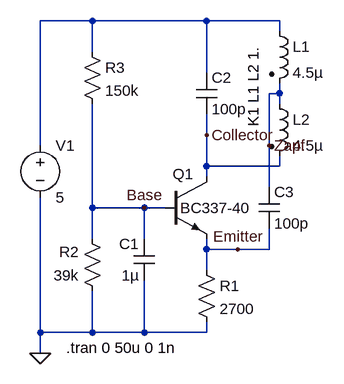
[diagram p0: schematic Draft6.asc]
Draft6.asc, the LTspice schematic file:
Version 4
SHEET 1 880 680
WIRE -752 -512 -832 -512
WIRE -576 -512 -752 -512
WIRE -464 -512 -576 -512
WIRE -464 -496 -464 -512
WIRE -752 -464 -752 -512
WIRE -576 -432 -576 -512
WIRE -464 -400 -464 -416
WIRE -464 -400 -480 -400
WIRE -464 -384 -464 -400
WIRE -576 -336 -576 -368
WIRE -832 -320 -832 -512
WIRE -480 -320 -480 -400
WIRE -576 -288 -576 -336
WIRE -464 -288 -464 -304
WIRE -464 -288 -576 -288
WIRE -576 -272 -576 -288
WIRE -480 -256 -480 -320
WIRE -752 -224 -752 -384
WIRE -672 -224 -752 -224
WIRE -640 -224 -672 -224
WIRE -752 -176 -752 -224
WIRE -672 -176 -672 -224
WIRE -576 -160 -576 -176
WIRE -528 -160 -576 -160
WIRE -480 -160 -480 -192
WIRE -480 -160 -528 -160
WIRE -576 -128 -576 -160
WIRE -832 -32 -832 -240
WIRE -752 -32 -752 -96
WIRE -752 -32 -832 -32
WIRE -672 -32 -672 -112
WIRE -672 -32 -752 -32
WIRE -576 -32 -576 -48
WIRE -576 -32 -672 -32
WIRE -832 0 -832 -32
FLAG -832 0 0
FLAG -672 -224 Base
FLAG -576 -336 Collector
FLAG -528 -160 Emitter
FLAG -480 -320 Zapf
SYMBOL ind2 -480 -512 R0
SYMATTR InstName L1
SYMATTR Value 4.5µ
SYMATTR Type ind
SYMBOL cap -656 -112 R180
WINDOW 0 24 56 Left 2
WINDOW 3 24 8 Left 2
SYMATTR InstName C1
SYMATTR Value 1µ
SYMBOL cap -592 -432 R0
SYMATTR InstName C2
SYMATTR Value 100p
SYMBOL cap -496 -256 R0
SYMATTR InstName C3
SYMATTR Value 100p
SYMBOL res -592 -144 R0
SYMATTR InstName R1
SYMATTR Value 2700
SYMBOL res -736 -80 R180
WINDOW 0 36 76 Left 2
WINDOW 3 36 40 Left 2
SYMATTR InstName R2
SYMATTR Value 39k
SYMBOL res -768 -480 R0
SYMATTR InstName R3
SYMATTR Value 150k
SYMBOL npn -640 -272 R0
WINDOW 0 12 -4 Left 2
WINDOW 3 23 48 Left 2
SYMATTR InstName Q1
SYMATTR Value BC337-40
SYMBOL voltage -832 -336 R0
WINDOW 123 0 0 Left 2
WINDOW 39 0 0 Left 2
SYMATTR InstName V1
SYMATTR Value 5
SYMBOL ind2 -480 -400 R0
SYMATTR InstName L2
SYMATTR Value 4.5µ
SYMATTR Type ind
TEXT -792 -8 Left 2 !.tran 0 50u 0 1n
TEXT -504 -472 VRight 2 !K1 L1 L2 1.

The netlist it stands for:
* Draft6.asc
L1 N001 Zapf 4.5µ
C1 0 Base 1µ
C2 N001 Collector 100p
C3 Zapf Emitter 100p
R1 Emitter 0 2700
R2 0 Base 39k
R3 N001 Base 150k
Q1 Collector Base Emitter 0 BC337-40
V1 N001 0 5
L2 Zapf Collector 4.5µ
.model NPN NPN
.model PNP PNP
.lib standard.bjt
.tran 0 50u 0 1n
K1 L1 L2 1.
.backanno
.end